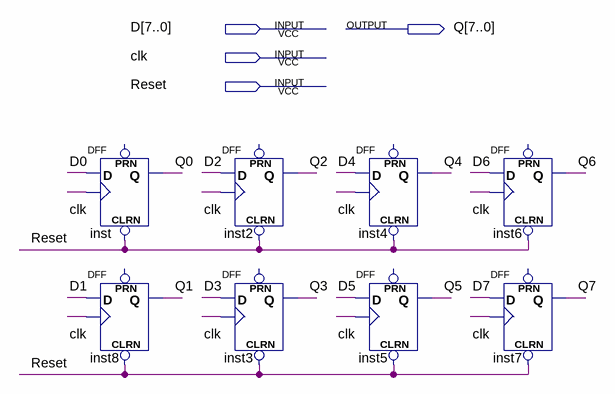
[diagram p0: schematic sheet]
// Quartus schematic DFFR8.bdf as structural Verilog: 8 symbols, 4 pins
module DFFR8 (
  input  [7:0] D,
  input  clk,
  input  Reset,
  output [7:0] Q
);

  DFF inst (.CLRN(Reset), .CLK(clk), .D(D[0]), .Q(Q[0]));  // open: PRN
  DFF inst8 (.CLRN(Reset), .CLK(clk), .D(D[1]), .Q(Q[1]));  // open: PRN
  DFF inst2 (.CLRN(Reset), .CLK(clk), .D(D[2]), .Q(Q[2]));  // open: PRN
  DFF inst3 (.CLRN(Reset), .CLK(clk), .D(D[3]), .Q(Q[3]));  // open: PRN
  DFF inst4 (.CLRN(Reset), .CLK(clk), .D(D[4]), .Q(Q[4]));  // open: PRN
  DFF inst5 (.CLRN(Reset), .CLK(clk), .D(D[5]), .Q(Q[5]));  // open: PRN
  DFF inst6 (.CLRN(Reset), .CLK(clk), .D(D[6]), .Q(Q[6]));  // open: PRN
  DFF inst7 (.CLRN(Reset), .CLK(clk), .D(D[7]), .Q(Q[7]));  // open: PRN
endmodule
